# Altium schematic sheet [12] - SD.SchDoc
size A3; DocumentNumber: 2; SheetNumber: 12; SheetTotal: 20
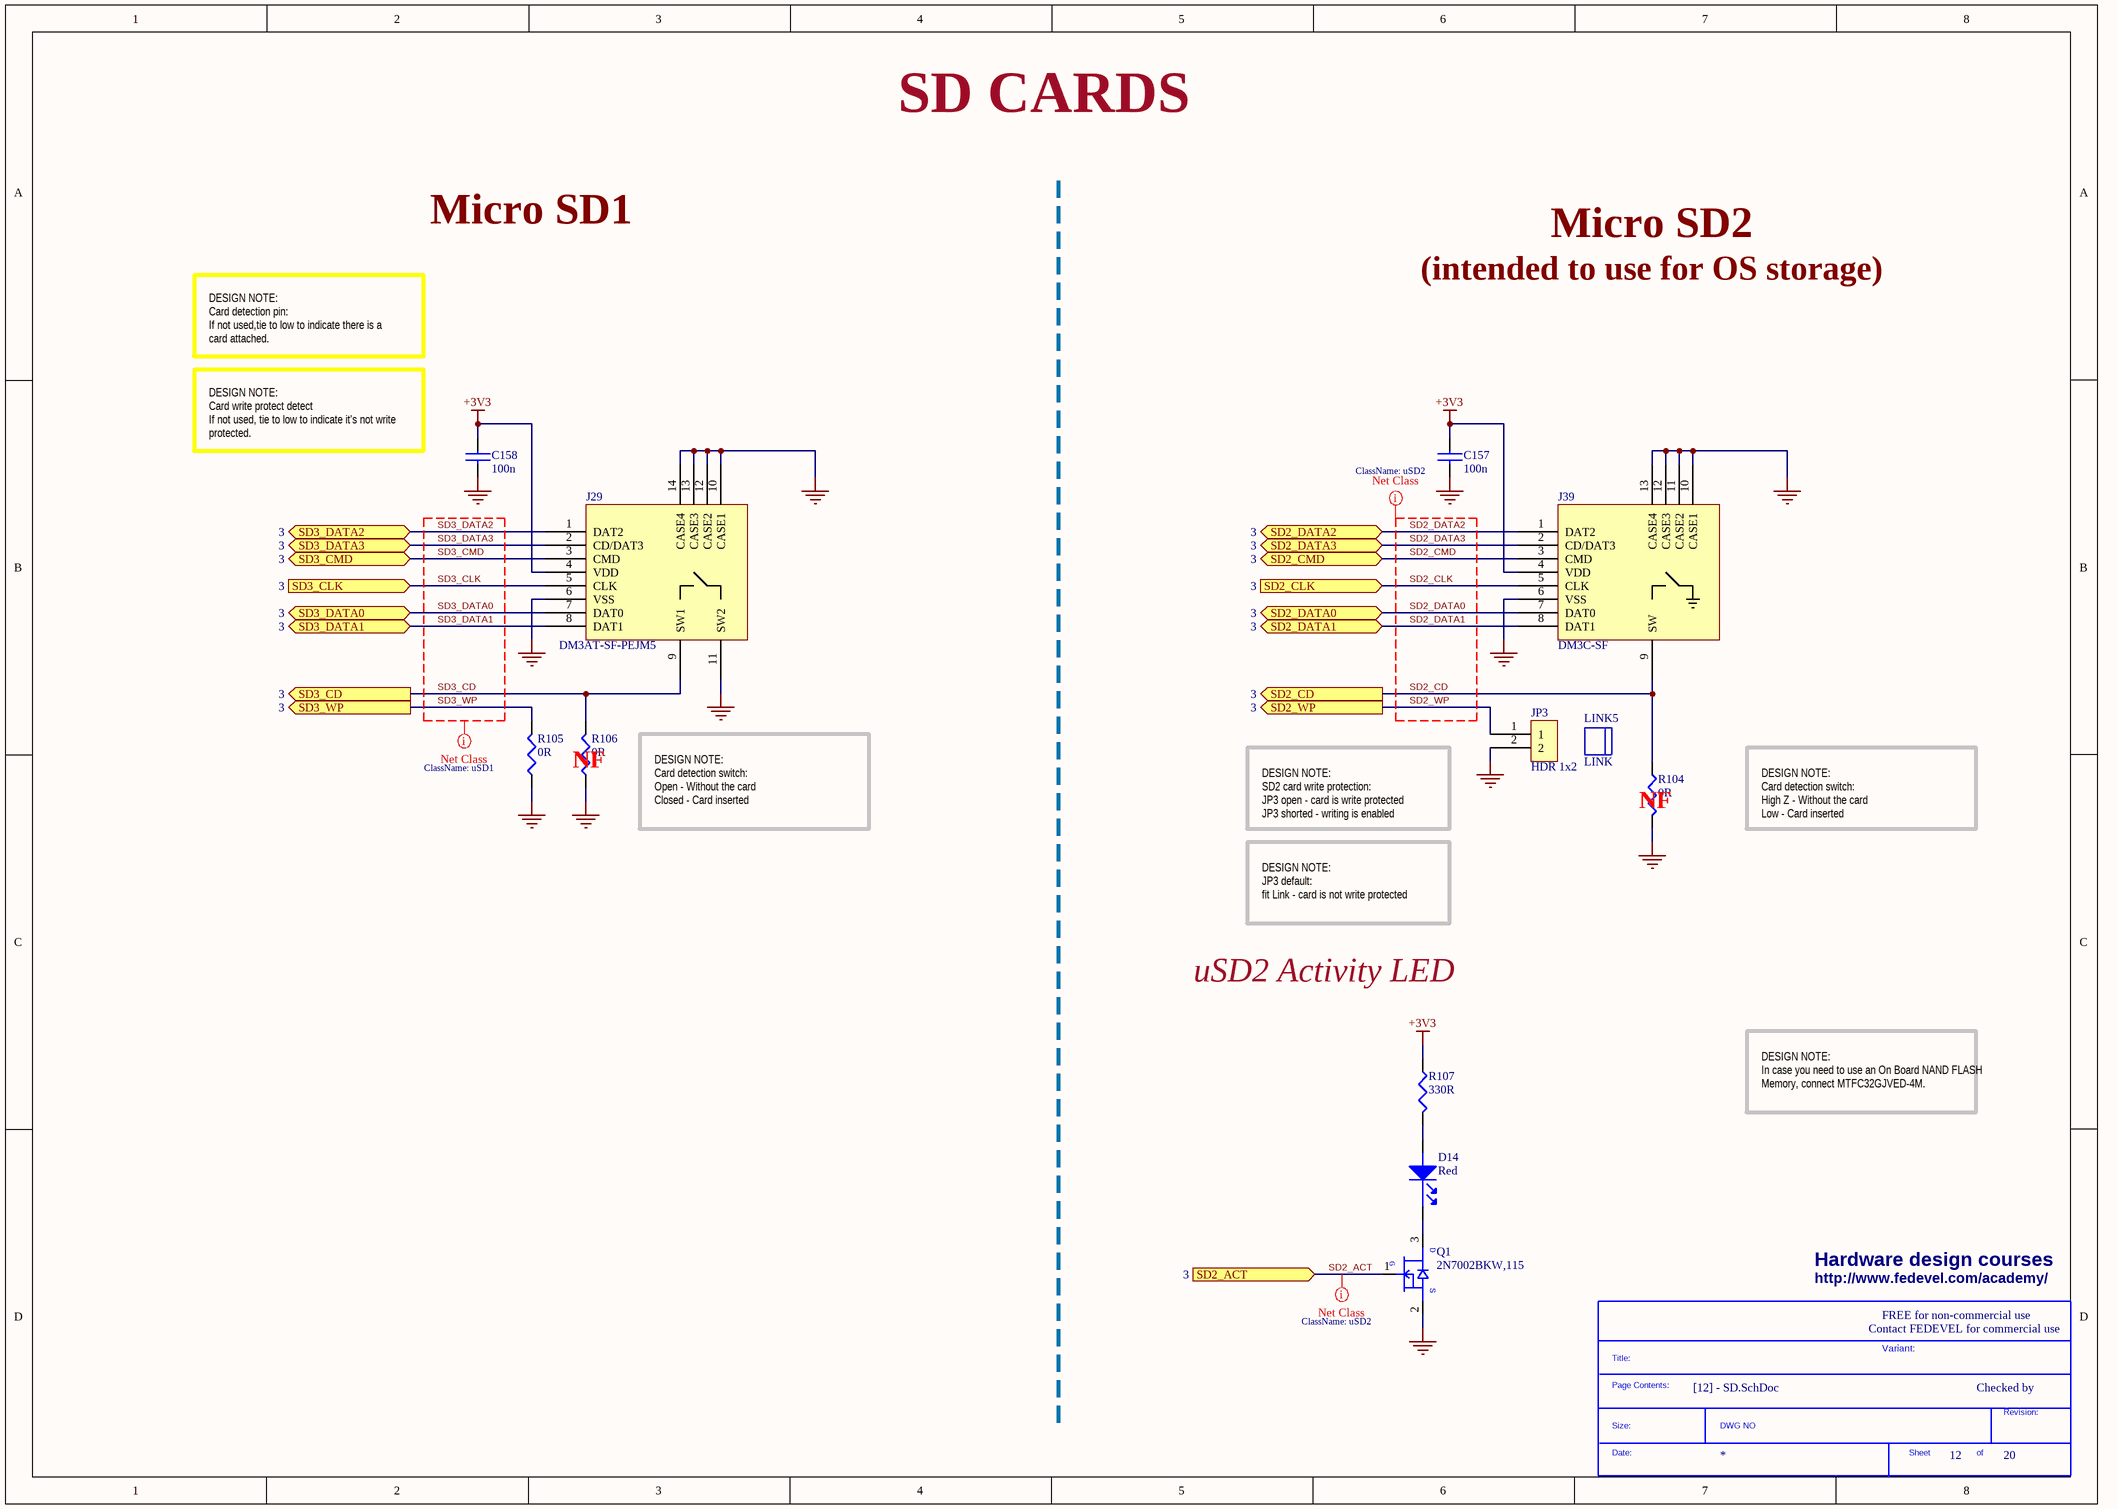
[diagram p0: [12] - SD.SchDoc]

## Parts
*  SDTitleBlock  (value not drawn)  (graphical)
C157  100n  [C0402]
C158  100n  [C0402]
D14  Red  [LED_0603]
J29  DM3AT-SF-PEJM5  [uSD_DM3AT]
J39  DM3C-SF  [uSD_DM3CS]
JP3  HDR 1x2  [HDR_1x2_2.54MM]
LINK5  LINK  (mechanical)
Q1  2N7002BKW,115  [SC70_SOT323]
R104  0R  [R0402]
R105  0R  [R0402]
R106  0R  [R0402]
R107  330R  [R0402]

## Ports
SD2_ACT (in, see 3), SD2_CD (out, see 3), SD2_CLK (in, see 3), SD2_CMD (bidir, see 3), SD2_DATA0 (bidir, see 3), SD2_DATA1 (bidir, see 3), SD2_DATA2 (bidir, see 3), SD2_DATA3 (bidir, see 3), SD2_WP (out, see 3), SD3_CD (out, see 3), SD3_CLK (in, see 3), SD3_CMD (bidir, see 3), SD3_DATA0 (bidir, see 3), SD3_DATA1 (bidir, see 3), SD3_DATA2 (bidir, see 3), SD3_DATA3 (bidir, see 3), SD3_WP (out, see 3)

## Nets
+3V3: C157.1 C158.1 J29.4(VDD) J39.4(VDD) R107.1
GND: C157.2 C158.2 J29.6(VSS) J29.10(CASE1) J29.11(SW2) J29.12(CASE2) J29.13(CASE3) J29.14(CASE4) J39.6(VSS) J39.10(CASE1) J39.11(CASE2) J39.12(CASE3) J39.13(CASE4) JP3.2 Q1.2(SOURCE) R104.1 R105.1 R106.1
SD2_ACT: Q1.1(GATE) ; port SD2_ACT
SD2_CD: J39.9(SW) R104.2 ; port SD2_CD
SD2_CLK: J39.5(CLK) ; port SD2_CLK
SD2_CMD: J39.3(CMD) ; port SD2_CMD
SD2_DATA0: J39.7(DAT0) ; port SD2_DATA0
SD2_DATA1: J39.8(DAT1) ; port SD2_DATA1
SD2_DATA2: J39.1(DAT2) ; port SD2_DATA2
SD2_DATA3: J39.2(CD/DAT3) ; port SD2_DATA3
SD2_WP: JP3.1 ; port SD2_WP
SD3_CD: J29.9(SW1) R106.2 ; port SD3_CD
SD3_CLK: J29.5(CLK) ; port SD3_CLK
SD3_CMD: J29.3(CMD) ; port SD3_CMD
SD3_DATA0: J29.7(DAT0) ; port SD3_DATA0
SD3_DATA1: J29.8(DAT1) ; port SD3_DATA1
SD3_DATA2: J29.1(DAT2) ; port SD3_DATA2
SD3_DATA3: J29.2(CD/DAT3) ; port SD3_DATA3
SD3_WP: R105.2 ; port SD3_WP
NetD14_1: D14.1(cathode) Q1.3(DRAIN)
NetD14_2: D14.2(ANODE) R107.2

## Layout directives
net class uSD2: SD2_ACT, SD2_CD, SD2_CLK, SD2_CMD, SD2_DATA0, SD2_DATA1, SD2_DATA2, SD2_DATA3, SD2_WP
net class uSD1: SD3_CD, SD3_CLK, SD3_CMD, SD3_DATA0, SD3_DATA1, SD3_DATA2, SD3_DATA3, SD3_WP

## Notes on the sheet
- SD CARDS
- Micro SD1
- Micro SD2
- (intended to use for OS storage)
- DESIGN NOTE:
  Card detection pin:
  If not used,tie to low to indicate there is a card attached.
- DESIGN NOTE:
  Card write protect detect
  If not used, tie to low to indicate it's not write protected.
- (near R106) NF
- DESIGN NOTE:
  Card detection switch:
  Open - Without the card
  Closed - Card inserted
- DESIGN NOTE:
  SD2 card write protection:
  JP3 open - card is write protected
  JP3 shorted - writing is enabled
- (near R104) NF
- DESIGN NOTE:
  Card detection switch:
  High Z - Without the card
  Low - Card inserted
- DESIGN NOTE:
  JP3 default:
  fit Link - card is not write protected
- uSD2 Activity LED
- DESIGN NOTE:
  In case you need to use an On Board NAND FLASH Memory, connect MTFC32GJVED-4M.
- Hardware design courses
- http://www.fedevel.com/academy/
- Contact FEDEVEL for commercial use
- FREE for non-commercial use
- Variant:
- Checked by
- (in symbol 2N7002BKW,115) D; G; S
- (in symbol SDTitleBlock) Title:; Page Contents:; Revision:; Size:; DWG NO; Date:; Sheet; of

## Library data of the parts
C157 C158 = C1005X5R1H104K: CAP CER .10UF 50V X5R 10% 0402; Manufacturer: TDK Corporation; Capacitance: 0.1µF; Value: 100nF; .Checked PCB: used; Description: CAP CER 0.1UF 50V 10% X5R 0402; Category: Capacitors; Supplier Part Number: 445-5942-1-ND; Manufacturer Part Number: C1005X5R1H104K; Operating Temperature: -55°C ~ 85°C; Package / Case: 0402 (1005 Metric); Price 1k [$]: 0.02340; .Checked SCH: used; Voltage - Rated: 50V; Supplier: Digikey; Supplier 1: Digi-Key; Supplier Part Number 1: 445-5942-1-ND; RoHS: RoHS Compliant; Stock 1: 106926; Pricing 1: 1=0.27, 10=0.18, 100=0.072, 250=0.05176, 500=0.0369, 1000=0.027 (USD); Tolerance: ±10%; Temperature Coefficient: X5R; Mounting Type: Surface Mount, MLCC; Applications: General Purpose; Ratings: -; Size / Dimension: 0.039" L x 0.020" W (1.00mm x 0.50mm); Height - Seated (Max): -; Thickness (Max): 0.022" (0.55mm); Lead Spacing: -; Features: -; Packaging: Cut Tape (CT); Lead Style: -; ComponentLink1URL: http://www.tdk.co.jp/tefe02/e412_c.pdf; ComponentLink1Description: http://www.tdk.co.jp/tefe02/e412_c.pdf
D14 = LS L29K-H1J2-1-Z: LED SMARTLED RED 630NM 0603 SMD; Manufacturer: OSRAM Opto Semiconductors Inc; Millicandela Rating: 4.95mcd; Voltage - Forward (Vf) Typ: 1.8V; Current - Test: 2mA; Wavelength - Peak: 643nm; Viewing Angle: 160°; Lens Type: Diffused; Lens Style/Size: Rectangle with Flat Top, 1.3mm x 0.8mm; Luminous Flux @ Current - Test: 20 mlm; .Checked PCB: RF; Supplier 1: Digi-Key; Supplier Part Number 1: 475-1195-1-ND; Manufacturer Part Number: LS L29K-H1J2-1-Z; RoHS: RoHS Compliant; Category: Optoelectronics; Stock 1: 71670; Pricing 1: 1=0.16, 10=0.137, 100=0.1093, 250=0.09564, 500=0.08744 (USD); Color: Red; Wavelength - Dominant: 630nm; Package / Case: 0603 (1608 Metric); Size / Dimension: 1.70mm L x 0.80mm W; Height: 0.65mm; Mounting Type: Surface Mount; Packaging: Cut Tape (CT); ComponentLink1URL: http://catalog.osram-os.com/catalogue/catalogue.do;jsessionid=DB7CFDBAC5AF1E216E45F622E867085A?act=downloadFile&favOid=020000010003f9de000100b6; ComponentLink1Description: http://catalog.osram-os.com/catalogue/catalogue.do;jsessionid=DB7CFDBAC5AF1E216E45F622E867085A?act=downloadFile&favOid=020000010003f9de000100b6; .Checked SCH: RF
J29 = DM3AT-SF-PEJM5: CONN MICRO SD R/A PUSH-PUSH SMD; Manufacturer: Hirose Electric Co Ltd; .Checked PCB: MM; Connector Type: Connector and Ejector; Card Type: Secure Digital - microSD TransFlash; Number of Positions: 10 (8 + 2); Insertion, Removal Method: Push In, Push Out; .Checked SCH: MM; Category: Connectors, Interconnects; Supplier Part Number: HR1964CT-ND; Family: Memory - PC Card Connectors; Manufacturer Part Number: DM3AT-SF-PEJM5; Price 1k [$]: 1.85200; Supplier: Digikey; Supplier 1: Digi-Key; Supplier Part Number 1: HR1964CT-ND; RoHS: RoHS Compliant; Stock 1: 7044; Pricing 1: 1=2.96, 10=2.457, 50=2.0476, 100=1.82, 250=1.5106, 500=1.365 (USD); Ejector Side: -; Mounting Type: Surface Mount, Right Angle; Features: Switch; Height Above Board: 0.066" (1.68mm); Mounting Feature: Normal, Standard - Top; Packaging: Cut Tape (CT); Contact Finish: Gold; Contact Finish Thickness: -; ComponentLink1URL: http://www.hirose.co.jp/cataloge_hp/e60900232.pdf; ComponentLink1Description: http://www.hirose.co.jp/cataloge_hp/e60900232.pdf
J39 = DM3C-SF: CONN MICRO SD R/A HING TYPE SMD; Manufacturer: Hirose Electric Co Ltd; Card Type: Secure Digital - microSD™; Number of Positions: 10 (8 + 2); Connector Type: Connector and Ejector; Insertion, Removal Method: Hinged Lid; .Creator: MM; Supplier 1: Digi-Key; Manufacturer Part Number: DM3C-SF; RoHS: RoHS Compliant; Category: Connectors, Interconnects; Stock 1: 87; Pricing 1: 1=2.36, 10=1.96, 25=1.8152, 50=1.6368, 100=1.452, 250=1.2738, 500=1.1616 (USD); Packaging: Cut Tape (CT); Ejector Side: -; Mounting Type: Surface Mount, Right Angle; Features: Switch; Height Above Board: 0.072" (1.83mm); Mounting Feature: Normal, Standard - Top; Contact Finish: Gold; Contact Finish Thickness: -; ComponentLink1URL: http://www.hirose.co.jp/cataloge_hp/e60900232.pdf; ComponentLink1Description: http://www.hirose.co.jp/cataloge_hp/e60900232.pdf; Supplier Part Number 1: HR1940CT-ND; .Checked PCB: MM; .Checked SCH: MM
JP3 = 68001-202HLF: BERGSTIK II .100" SR STRAIGHT; Manufacturer: FCI; Connector Type: Header, Unshrouded; Number of Positions: 2; Number of Positions Loaded: All; Pitch: 0.100" (2.54mm); .Checked PCB: RF; Supplier 1: Digi-Key; Supplier Part Number 1: 609-3469-ND; Manufacturer Part Number: 68001-202HLF; RoHS: RoHS Compliant; Category: Connectors, Interconnects; Stock 1: 13680; Pricing 1: 1=0.45, 10=0.265, 100=0.1172, 250=0.09828, 500=0.09072, 1000=0.07938, 5000=0.05065 (USD); Contact Type: Male Pin; Number of Rows: 1; Row Spacing: -; Contact Mating Length: 0.230" (5.84mm); Mounting Type: Through Hole; Termination: Solder; Fastening Type: -; Features: -; Contact Finish: Gold; Contact Finish Thickness: 15µin (0.38µm); Color: Black; Packaging: Bulk; ComponentLink1URL: http://portal.fciconnect.com/res/en/pdffiles/doc_search/68000.pdf; ComponentLink1Description: http://portal.fciconnect.com/res/en/pdffiles/doc_search/68000.pdf; .Checked SCH: RF
LINK5 = QPC02SXGN-RC: CONN JUMPER SHORTING .100" GOLD; Manufacturer: Sullins Connector Solutions; Gender: Female Sockets; Number of Positions or Pins (Grid): 2 (1 x 2); Pitch: 0.100" (2.54mm); .Checked SCH: RF; Supplier 1: Digi-Key; Supplier Part Number 1: S9337-ND; Manufacturer Part Number: QPC02SXGN-RC; RoHS: RoHS Compliant; Category: Connectors, Interconnects; Stock 1: 23274; Pricing 1: 1=0.11, 10=0.066, 25=0.0468, 50=0.0384, 100=0.033, 250=0.02792, 500=0.0258, 1000=0.0228, 2500=0.018 (USD); Type: Open Top; Height: 0.235" (5.97mm); Contact Finish: Gold; Contact Finish Thickness: Flash; Color: -; Packaging: Bulk; ComponentLink1URL: http://www.sullinscorp.com/drawings/284_SXGN_11510.pdf; ComponentLink1Description: http://www.sullinscorp.com/drawings/284_SXGN_11510.pdf
Q1 = 2N7002BKW,115: MOSFET N-CH 60V 310MA SOT323; Manufacturer: NXP Semiconductors; FET Type: MOSFET N-Channel, Metal Oxide; FET Feature: Logic Level Gate; Rds On (Max) @ Id, Vgs: 1.6 Ohm @ 500mA, 10V; Vgs(th) (Max) @ Id: 2.1V @ 250µA; Gate Charge (Qg) @ Vgs: 0.6nC @ 4.5V; Input Capacitance (Ciss) @ Vds: 50pF @ 10V; Power - Max: 275mW; .Checked PCB: RF; Supplier 1: Digi-Key; Supplier Part Number 1: 568-5980-1-ND; Manufacturer Part Number: 2N7002BKW,115; RoHS: RoHS Compliant; Category: Discrete Semiconductor Products; Stock 1: 15666; Pricing 1: 1=0.39, 10=0.354, 25=0.2548, 100=0.1983, 250=0.12456, 500=0.10616, 1000=0.07233 (USD); Drain to Source Voltage (Vdss): 60V; Current - Continuous Drain (Id) @ 25° C: 310mA; Mounting Type: Surface Mount; Package / Case: SC-70, SOT-323; Supplier Device Package: SC-70; Packaging: Cut Tape (CT); ComponentLink1URL: http://www.nxp.com/documents/data_sheet/2N7002BKW.pdf; ComponentLink1Description: http://www.nxp.com/documents/data_sheet/2N7002BKW.pdf; .Checked SCH: RF
R104-R106 = RC0402JR-070RL: RES 0.0 OHM 1/16W 0402 SMD; Manufacturer: Yageo; Resistance (Ohms): 0.0; Power (Watts): 0.063W, 1/16W; Tolerance: Jumper; .Checked PCB: used; Category: Resistors; Supplier Part Number: 311-0.0JRCT-ND; Manufacturer Part Number: RC0402JR-070RL; Package / Case: 0402 (1005 Metric); Price 1k [$]: 0.01389; Value: 0R; .Checked SCH: used; Supplier: Digikey; Supplier 1: Digi-Key; Supplier Part Number 1: 311-0.0JRCT-ND; RoHS: RoHS Compliant; Stock 1: 1106330; Pricing 1: 10=0.012, 50=0.009, 100=0.0069, 250=0.00512, 500=0.0038, 1000=0.00253 (USD); Composition: Thick Film; Features: -; Temperature Coefficient: -; Size / Dimension: 0.039" L x 0.020" W (1.00mm x 0.50mm); Height: 0.016" (0.40mm); Number of Terminations: 2; Packaging: Cut Tape (CT); ComponentLink1URL: http://www.yageo.com/documents/recent/PYu-RC0402_51_RoHS_L_6.pdf; ComponentLink1Description: http://www.yageo.com/documents/recent/PYu-RC0402_51_RoHS_L_6.pdf
R107 = CRCW0402330RFKED: RES 330 OHM 1/16W 1% 0402 SMD; Manufacturer: Vishay Dale; Resistance (Ohms): 330; Power (Watts): 0.063W, 1/16W; Temperature Coefficient: ±100ppm/°C; .Checked PCB: RF; Supplier 1: Digi-Key; Supplier Part Number 1: 541-330LCT-ND; Manufacturer Part Number: CRCW0402330RFKED; RoHS: RoHS Compliant; Category: Resistors; Stock 1: 49303; Pricing 1: 10=0.083, 50=0.0444, 200=0.0255, 1000=0.0174 (USD); Composition: Thick Film; Features: -; Tolerance: ±1%; Package / Case: 0402 (1005 Metric); Size / Dimension: 0.039" L x 0.020" W (1.00mm x 0.50mm); Height: 0.016" (0.40mm); Number of Terminations: 2; Packaging: Cut Tape (CT); ComponentLink1URL: http://www.vishay.com/doc?20035; ComponentLink1Description: http://www.vishay.com/doc?20035; .Checked SCH: RF